# EAGLE schematic LED Cube PCB Board V.6 (EAGLE 9.0.1)
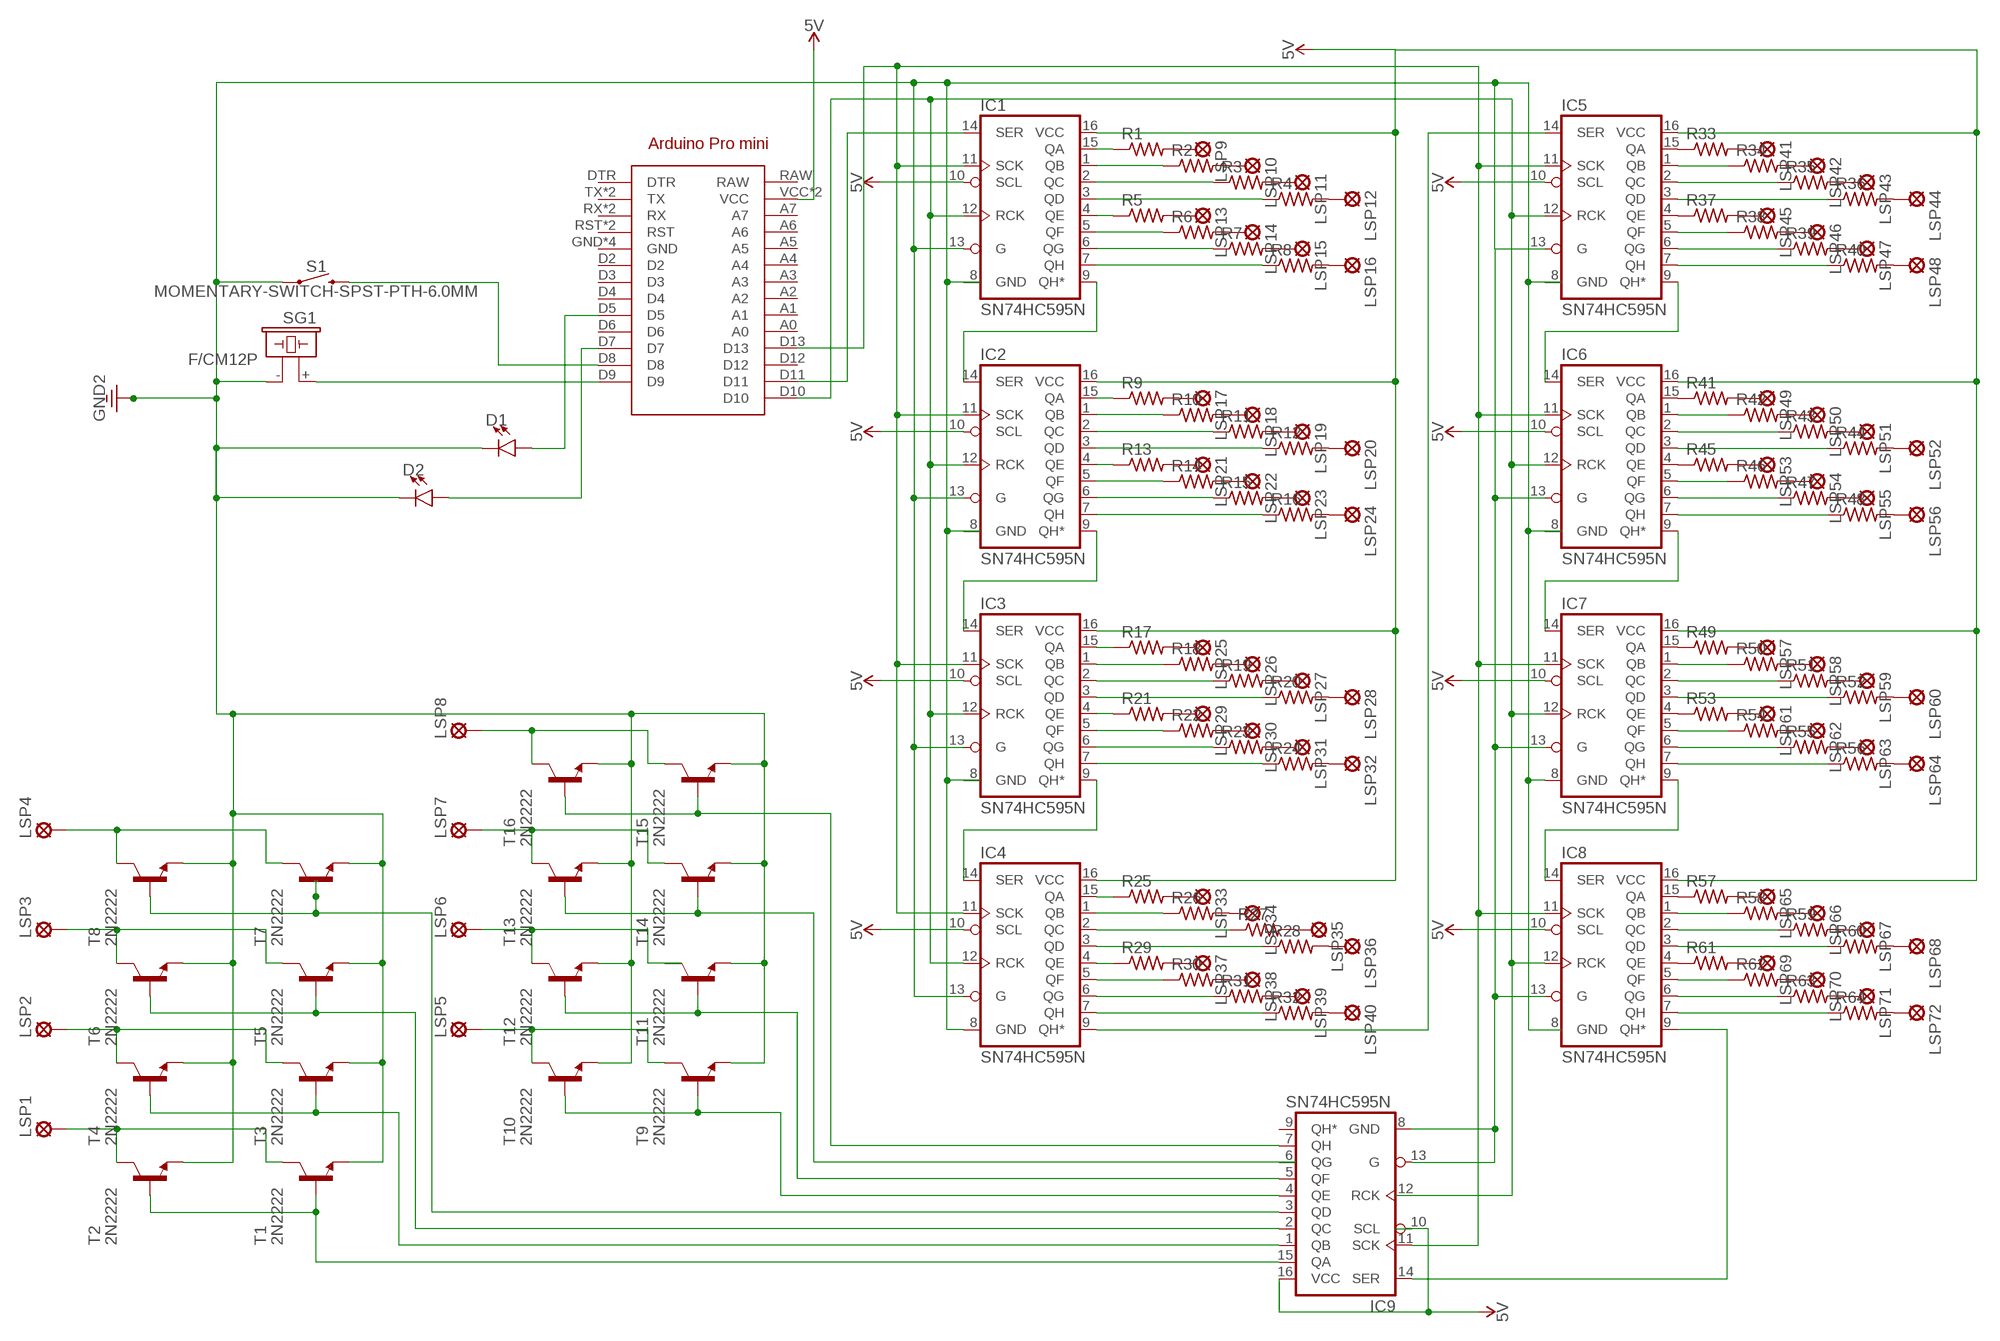
[diagram p0: schematic, sheet 1]

## Parts
ARDUINO1  ARDUINO_PRO_MINI  [ARDUINO_PRO_MINI]
D1  LED-3MM-NO_SILK  [LED_3MM-NS]
D2  LED-3MM-NO_SILK  [LED_3MM-NS]
IC1  SN74HC595N  74HC595N  [DIP16]
IC2  SN74HC595N  74HC595N  [DIP16]
IC3  SN74HC595N  74HC595N  [DIP16]
IC4  SN74HC595N  74HC595N  [DIP16]
IC5  SN74HC595N  74HC595N  [DIP16]
IC6  SN74HC595N  74HC595N  [DIP16]
IC7  SN74HC595N  74HC595N  [DIP16]
IC8  SN74HC595N  74HC595N  [DIP16]
IC9  SN74HC595N  74HC595N  [DIP16]
LSP1  LSP10  [LSP10]
LSP2  LSP10  [LSP10]
LSP3  LSP10  [LSP10]
LSP4  LSP10  [LSP10]
LSP5  LSP10  [LSP10]
LSP6  LSP10  [LSP10]
LSP7  LSP10  [LSP10]
LSP8  LSP10  [LSP10]
LSP9  LSP11  [LSP11]
LSP10  LSP11  [LSP11]
LSP11  LSP11  [LSP11]
LSP12  LSP11  [LSP11]
LSP13  LSP11  [LSP11]
LSP14  LSP11  [LSP11]
LSP15  LSP11  [LSP11]
LSP16  LSP11  [LSP11]
LSP17  LSP11  [LSP11]
LSP18  LSP11  [LSP11]
LSP19  LSP11  [LSP11]
LSP20  LSP11  [LSP11]
LSP21  LSP11  [LSP11]
LSP22  LSP11  [LSP11]
LSP23  LSP11  [LSP11]
LSP24  LSP11  [LSP11]
LSP25  LSP11  [LSP11]
LSP26  LSP11  [LSP11]
LSP27  LSP11  [LSP11]
LSP28  LSP11  [LSP11]
LSP29  LSP11  [LSP11]
LSP30  LSP11  [LSP11]
LSP31  LSP11  [LSP11]
LSP32  LSP11  [LSP11]
LSP33  LSP11  [LSP11]
LSP34  LSP11  [LSP11]
LSP35  LSP11  [LSP11]
LSP36  LSP11  [LSP11]
LSP37  LSP11  [LSP11]
LSP38  LSP11  [LSP11]
LSP39  LSP11  [LSP11]
LSP40  LSP11  [LSP11]
LSP41  LSP11  [LSP11]
LSP42  LSP11  [LSP11]
LSP43  LSP11  [LSP11]
LSP44  LSP11  [LSP11]
LSP45  LSP11  [LSP11]
LSP46  LSP11  [LSP11]
LSP47  LSP11  [LSP11]
LSP48  LSP11  [LSP11]
LSP49  LSP11  [LSP11]
LSP50  LSP11  [LSP11]
LSP51  LSP11  [LSP11]
LSP52  LSP11  [LSP11]
LSP53  LSP11  [LSP11]
LSP54  LSP11  [LSP11]
LSP55  LSP11  [LSP11]
LSP56  LSP11  [LSP11]
LSP57  LSP11  [LSP11]
LSP58  LSP11  [LSP11]
LSP59  LSP11  [LSP11]
LSP60  LSP11  [LSP11]
LSP61  LSP11  [LSP11]
LSP62  LSP11  [LSP11]
LSP63  LSP11  [LSP11]
LSP64  LSP11  [LSP11]
LSP65  LSP11  [LSP11]
LSP66  LSP11  [LSP11]
LSP67  LSP11  [LSP11]
LSP68  LSP11  [LSP11]
LSP69  LSP11  [LSP11]
LSP70  LSP11  [LSP11]
LSP71  LSP11  [LSP11]
LSP72  LSP11  [LSP11]
R1  R-US_0204/5  [0204/5]
R2  R-US_0204/5  [0204/5]
R3  R-US_0204/5  [0204/5]
R4  R-US_0204/5  [0204/5]
R5  R-US_0204/5  [0204/5]
R6  R-US_0204/5  [0204/5]
R7  R-US_0204/5  [0204/5]
R8  R-US_0204/5  [0204/5]
R9  R-US_0204/5  [0204/5]
R10  R-US_0204/5  [0204/5]
R11  R-US_0204/5  [0204/5]
R12  R-US_0204/5  [0204/5]
R13  R-US_0204/5  [0204/5]
R14  R-US_0204/5  [0204/5]
R15  R-US_0204/5  [0204/5]
R16  R-US_0204/5  [0204/5]
R17  R-US_0204/5  [0204/5]
R18  R-US_0204/5  [0204/5]
R19  R-US_0204/5  [0204/5]
R20  R-US_0204/5  [0204/5]
R21  R-US_0204/5  [0204/5]
R22  R-US_0204/5  [0204/5]
R23  R-US_0204/5  [0204/5]
R24  R-US_0204/5  [0204/5]
R25  R-US_0204/5  [0204/5]
R26  R-US_0204/5  [0204/5]
R27  R-US_0204/5  [0204/5]
R28  R-US_0204/5  [0204/5]
R29  R-US_0204/5  [0204/5]
R30  R-US_0204/5  [0204/5]
R31  R-US_0204/5  [0204/5]
R32  R-US_0204/5  [0204/5]
R33  R-US_0204/5  [0204/5]
R34  R-US_0204/5  [0204/5]
R35  R-US_0204/5  [0204/5]
R36  R-US_0204/5  [0204/5]
R37  R-US_0204/5  [0204/5]
R38  R-US_0204/5  [0204/5]
R39  R-US_0204/5  [0204/5]
R40  R-US_0204/5  [0204/5]
R41  R-US_0204/5  [0204/5]
R42  R-US_0204/5  [0204/5]
R43  R-US_0204/5  [0204/5]
R44  R-US_0204/5  [0204/5]
R45  R-US_0204/5  [0204/5]
R46  R-US_0204/5  [0204/5]
R47  R-US_0204/5  [0204/5]
R48  R-US_0204/5  [0204/5]
R49  R-US_0204/5  [0204/5]
R50  R-US_0204/5  [0204/5]
R51  R-US_0204/5  [0204/5]
R52  R-US_0204/5  [0204/5]
R53  R-US_0204/5  [0204/5]
R54  R-US_0204/5  [0204/5]
R55  R-US_0204/5  [0204/5]
R56  R-US_0204/5  [0204/5]
R57  R-US_0204/5  [0204/5]
R58  R-US_0204/5  [0204/5]
R59  R-US_0204/5  [0204/5]
R60  R-US_0204/5  [0204/5]
R61  R-US_0204/5  [0204/5]
R62  R-US_0204/5  [0204/5]
R63  R-US_0204/5  [0204/5]
R64  R-US_0204/5  [0204/5]
S1  MOMENTARY-SWITCH-SPST-PTH-6.0MM  [TACTILE_SWITCH_PTH_6.0MM]
SG1  F/CM12P  [F/CM12P]
T1  2N2222  [TO92-EBC-OVAL]
T2  2N2222  [TO92-EBC-OVAL]
T3  2N2222  [TO92-EBC-OVAL]
T4  2N2222  [TO92-EBC-OVAL]
T5  2N2222  [TO92-EBC-OVAL]
T6  2N2222  [TO92-EBC-OVAL]
T7  2N2222  [TO92-EBC-OVAL]
T8  2N2222  [TO92-EBC-OVAL]
T9  2N2222  [TO92-EBC-OVAL]
T10  2N2222  [TO92-EBC-OVAL]
T11  2N2222  [TO92-EBC-OVAL]
T12  2N2222  [TO92-EBC-OVAL]
T13  2N2222  [TO92-EBC-OVAL]
T14  2N2222  [TO92-EBC-OVAL]
T15  2N2222  [TO92-EBC-OVAL]
T16  2N2222  [TO92-EBC-OVAL]

## Nets
5V: ARDUINO1.VCC ARDUINO1.VCC@1(VCC) IC1.10(SCL) IC1.16(VCC) IC2.16(VCC) IC3.16(VCC) IC4.16(VCC) IC5.10(SCL) IC5.16(VCC) IC6.10(SCL) IC6.16(VCC) IC7.10(SCL) IC7.16(VCC) IC8.10(SCL) IC8.16(VCC) IC9.10(SCL) IC9.16(VCC)
GND: D1.K(C) D2.K(C) IC1.13(G) IC2.13(G) IC3.13(G) IC4.8(GND) IC4.13(G) IC5.8(GND) IC5.13(G) IC6.8(GND) IC6.13(G) IC7.8(GND) IC7.13(G) IC8.8(GND) IC8.13(G) IC9.8(GND) IC9.13(G) S1.1 SG1.- T1.E T2.E T3.E T4.E T5.E T6.E T7.E T8.E T9.E T10.E T11.E T12.E T13.E T14.E T15.E T16.E ; supply symbol labelled GND2
N$1: IC1.7(QH) R8.1
N$2: IC1.6(QG) R7.1
N$3: IC1.5(QF) R6.1
N$4: IC1.4(QE) R5.1
N$5: IC1.3(QD) R4.1
N$6: IC1.2(QC) R3.1
N$7: IC1.1(QB) R2.1
N$8: IC1.15(QA) R1.1
N$9: LSP9.MP R1.2
N$10: LSP10.MP R2.2
N$11: LSP11.MP R3.2
N$12: LSP12.MP R4.2
N$13: LSP13.MP R5.2
N$14: LSP14.MP R6.2
N$15: LSP15.MP R7.2
N$16: LSP16.MP R8.2
N$17: IC6.1(QB) R42.1
N$18: IC6.2(QC) R43.1
N$19: IC6.3(QD) R44.1
N$20: IC6.5(QF) R46.1
N$21: IC6.6(QG) R47.1
N$22: IC6.7(QH) R48.1
N$23: IC8.1(QB) R58.1
N$24: IC8.2(QC) R59.1
N$25: IC8.3(QD) R60.1
N$26: IC8.5(QF) R62.1
N$27: IC8.6(QG) R63.1
N$28: IC8.7(QH) R64.1
N$29: IC9.7(QH) T15.B T16.B
N$30: T13.B T14.B
N$31: IC9.5(QF) T11.B T12.B
N$32: IC9.4(QE) T9.B T10.B
N$33: IC2.7(QH) R16.1
N$34: IC2.6(QG) R15.1
N$35: IC2.5(QF) R14.1
N$36: IC2.4(QE) R13.1
N$37: IC2.3(QD) R12.1
N$38: IC2.2(QC) R11.1
N$39: IC2.1(QB) R10.1
N$40: IC2.15(QA) R9.1
N$41: IC5.15(QA) R33.1
N$42: IC5.4(QE) R37.1
N$43: IC6.15(QA) R41.1
N$44: IC6.4(QE) R45.1
N$45: IC8.15(QA) R57.1
N$46: IC8.4(QE) R61.1
N$47: IC7.4(QE) R53.1
N$48: IC7.15(QA) R49.1
N$49: IC4.1(QB) R26.1
N$50: IC4.15(QA) R25.1
N$51: LSP17.MP R9.2
N$52: IC4.2(QC) R27.1
N$53: LSP18.MP R10.2
N$54: IC4.3(QD) R28.1
N$55: IC4.4(QE) R29.1
N$56: IC4.5(QF) R30.1
N$57: IC3.1(QB) R18.1
N$58: IC4.6(QG) R31.1
N$59: IC4.7(QH) R32.1
N$60: LSP19.MP R11.2
N$61: LSP20.MP R12.2
N$62: LSP21.MP R13.2
N$63: LSP22.MP R14.2
N$64: LSP23.MP R15.2
N$65: IC3.7(QH) R24.1
N$66: IC3.6(QG) R23.1
N$67: IC3.5(QF) R22.1
N$68: IC3.4(QE) R21.1
N$69: IC3.3(QD) R20.1
N$70: IC3.2(QC) R19.1
N$71: LSP24.MP R16.2
N$72: IC3.15(QA) R17.1
N$73: LSP25.MP R17.2
N$74: LSP26.MP R18.2
N$75: LSP27.MP R19.2
N$76: LSP28.MP R20.2
N$77: LSP29.MP R21.2
N$78: LSP30.MP R22.2
N$79: LSP31.MP R23.2
N$80: LSP32.MP R24.2
N$81: IC5.7(QH) R40.1
N$82: IC5.6(QG) R39.1
N$83: IC5.5(QF) R38.1
N$84: LSP33.MP R25.2
N$85: IC5.3(QD) R36.1
N$86: IC5.2(QC) R35.1
N$87: IC5.1(QB) R34.1
N$88: LSP34.MP R26.2
N$89: LSP35.MP R27.2
N$90: LSP36.MP R28.2
N$91: LSP37.MP R29.2
N$92: LSP38.MP R30.2
N$93: LSP39.MP R31.2
N$94: LSP40.MP R32.2
N$95: LSP41.MP R33.2
N$96: LSP42.MP R34.2
N$97: LSP43.MP R35.2
N$98: LSP44.MP R36.2
N$99: LSP45.MP R37.2
N$100: LSP46.MP R38.2
N$101: LSP47.MP R39.2
N$102: LSP48.MP R40.2
N$103: LSP49.MP R41.2
N$104: LSP50.MP R42.2
N$105: LSP51.MP R43.2
N$106: LSP52.MP R44.2
N$107: LSP53.MP R45.2
N$108: LSP54.MP R46.2
N$109: LSP55.MP R47.2
N$110: LSP56.MP R48.2
N$111: LSP57.MP R49.2
N$112: LSP58.MP R50.2
N$113: IC7.7(QH) R56.1
N$114: IC7.6(QG) R55.1
N$115: IC7.5(QF) R54.1
N$116: LSP59.MP R51.2
N$117: IC7.3(QD) R52.1
N$118: IC7.2(QC) R51.1
N$119: IC7.1(QB) R50.1
N$120: LSP60.MP R52.2
N$121: LSP61.MP R53.2
N$122: LSP62.MP R54.2
N$123: LSP63.MP R55.2
N$124: LSP64.MP R56.2
N$125: LSP65.MP R57.2
N$126: LSP66.MP R58.2
N$127: LSP67.MP R59.2
N$128: LSP68.MP R60.2
N$129: IC1.9(QH*) IC2.14(SER)
N$130: IC5.9(QH*) IC6.14(SER)
N$131: IC6.9(QH*) IC7.14(SER)
N$132: IC2.9(QH*) IC3.14(SER)
N$133: IC3.9(QH*) IC4.14(SER)
N$134: IC7.9(QH*) IC8.14(SER)
N$135: ARDUINO1.D8 S1.3
N$136: ARDUINO1.D10 IC1.12(RCK) IC2.12(RCK) IC3.12(RCK) IC4.12(RCK) IC5.12(RCK) IC6.12(RCK) IC7.12(RCK) IC8.12(RCK)
N$137: ARDUINO1.D11 IC1.14(SER)
N$138: ARDUINO1.D13 IC1.11(SCK) IC2.11(SCK) IC3.11(SCK) IC4.11(SCK) IC5.11(SCK) IC6.11(SCK) IC7.11(SCK) IC8.11(SCK) IC9.11(SCK)
N$139: IC8.9(QH*) IC9.14(SER)
N$140: ARDUINO1.D5 D1.A
N$141: IC9.1(QB) T3.B T4.B
N$142: IC4.9(QH*) IC5.14(SER)
N$143: IC9.2(QC) T5.B T6.B
N$144: IC9.3(QD) T7.B T8.B
N$145: LSP69.MP R61.2
N$146: LSP70.MP R62.2
N$147: LSP71.MP R63.2
N$148: IC9.15(QA) T1.B T2.B
N$149: LSP72.MP R64.2
N$150: ARDUINO1.D7 D2.A
N$151: LSP3.MP T5.C T6.C
N$152: LSP4.MP T7.C T8.C
N$153: LSP2.MP T3.C T4.C
N$154: LSP1.MP T1.C T2.C
N$155: LSP8.MP T15.C T16.C
N$156: LSP7.MP T13.C T14.C
N$157: LSP6.MP T12.C
N$158: LSP5.MP T9.C T10.C
N$159: ARDUINO1.D9 SG1.+
Unconnected: ARDUINO1.A0 ARDUINO1.A1 ARDUINO1.A2 ARDUINO1.A3 ARDUINO1.A4 ARDUINO1.A5 ARDUINO1.A6 ARDUINO1.A7 ARDUINO1.D2 ARDUINO1.D3 ARDUINO1.D4 ARDUINO1.D6 ARDUINO1.D12 ARDUINO1.DTR ARDUINO1.RAW ARDUINO1.RST ARDUINO1.RST@1(RST) ARDUINO1.RX ARDUINO1.RX@1(RX) ARDUINO1.TX ARDUINO1.TX@1(TX) IC2.10(SCL) IC3.10(SCL) IC4.10(SCL) IC9.6(QG) IC9.9(QH*) IC9.12(RCK) T11.C

## Power pins joined to a net without a drawn wire
GND: ARDUINO1.GND ARDUINO1.GND@1(GND) ARDUINO1.GND@2(GND) ARDUINO1.GND@3(GND) IC1.8(GND) IC2.8(GND) IC3.8(GND)

## Library data of the parts
ARDUINO1 = arduinopromini:ARDUINO_PRO_MINI: For creating Arduino Pro Mini shields
D1 D2 = SparkFun-LED:LED: LED (Generic) Standard schematic elements and footprints for 5mm, 3mm, 1206, and 0603 sized LEDs. Generic LEDs with no color specified.
IC1-IC9 = SparkFun-IC-Logic:74*595: 8-Bit Shift Register (Serial to Parallel) Datasheet <http://cdn.sparkfun.com/datasheets/BreakoutBoards/MM74HC595.pdf> SparkFun Products SparkFun Shift Register Breakout - 74HC595 <https://www.sparkfun.com/products/10680> (BOB-10680); PROD_ID: IC-13123
LSP1-LSP8 = solpad:LSP10: SOLDER PAD drill 1.0 mm, distributor Buerklin, 12H555
LSP9-LSP72 = solpad:LSP11: SOLDER PAD drill 1.1 mm
R1-R64 = adafruit:R-US_: RESISTOR, American symbol
S1 = SparkFun-Switches:MOMENTARY-SWITCH-SPST: Momentary Switch (Pushbutton) - SPST Normally-open (NO) SPST momentary switches (buttons, pushbuttons). Variants PTH-12MM - 12mm square, through-hole Momentary Pushbutton Switch - 12mm Square <https://www.sparkfun.com/products/9190> (COM-09190) PTH-6.0MM, PTH-6.0MM-KIT - 6.0mm square, through-hole Mini Pushbutton Switch <https://www.sparkfun.com/products/97> (COM-00097) KIT package intended for soldering kit's - only one side of pads' copper is exposed. PTH-RIGHT-ANGLE-KIT - Right-angle, through-hole Right Angle Tactile Button <https://www.sparkfun.com/products/10791> - Used on SparkFun BigTime Watch Kit <https://www.sparkfun.com/products/11734> SMD-12MM - 12mm square, surface-mount Tactile Button - SMD (12mm) <https://www.sparkfun.com/products/12993> (COM-12993) Used on SparkFun PicoBoard <https://www.sparkfun.com/products/11888> SMD-4.5MM - 4.5mm Square Trackball Switch Used on SparkFun Blackberry Trackballer Breakout <https://www.sparkfun.com/products/13169> SMD-4.6MMX2.8MM - 4.60mm x 2.80mm, surface mount Used on SparkFun SAMD21 Mini Breakout <https://www.sparkfun.com/products/13664> SMD-5.2MM, SMD-5.2-REDUNDANT - 5.2mm square, surface-mount Mini Pushbutton Switch - SMD <https://www.sparkfun.com/products/8720> (COM-08720) Used on Arduino Pro Mini <https://www.sparkfun.com/products/11114> REDUNDANT package connects both switch circuits together SMD-6.0X3.5MM - 6.0 x 3.5mm, surface mount Momentary Reset Switch SMD <https://www.sparkfun.com/products/8229> (COM-08229) SMD-6.2MM-TALL - 6.2mm square, surface mount Tactile Button - SMD (6mm) <https://www.sparkfun.com/products/12992> Used on SparkFun Digital Sandbox <https://www.sparkfun.com/products/12651> SMD-RIGHT-ANGLE - Right-angle, surface mount Used on SparkFun Block for Intel® Edison - Arduino <https://www.sparkfun.com/products/13036>; PROD_ID: SWCH-08441; SF_SKU: COM-00097
SG1 = buzzer:F/CM12P: BUZZER Source: Buerklin; OC_FARNELL: unknown; OC_NEWARK: unknown
T1-T16 = adafruit:2N2222: NPN TRANSISTOR Big oval pads

## Net classes
0 default: width 0.305 mm, drill 0.508 mm, clearance 0.203 mm